# Altium schematic sheet Connectors.SchDoc
size Letter
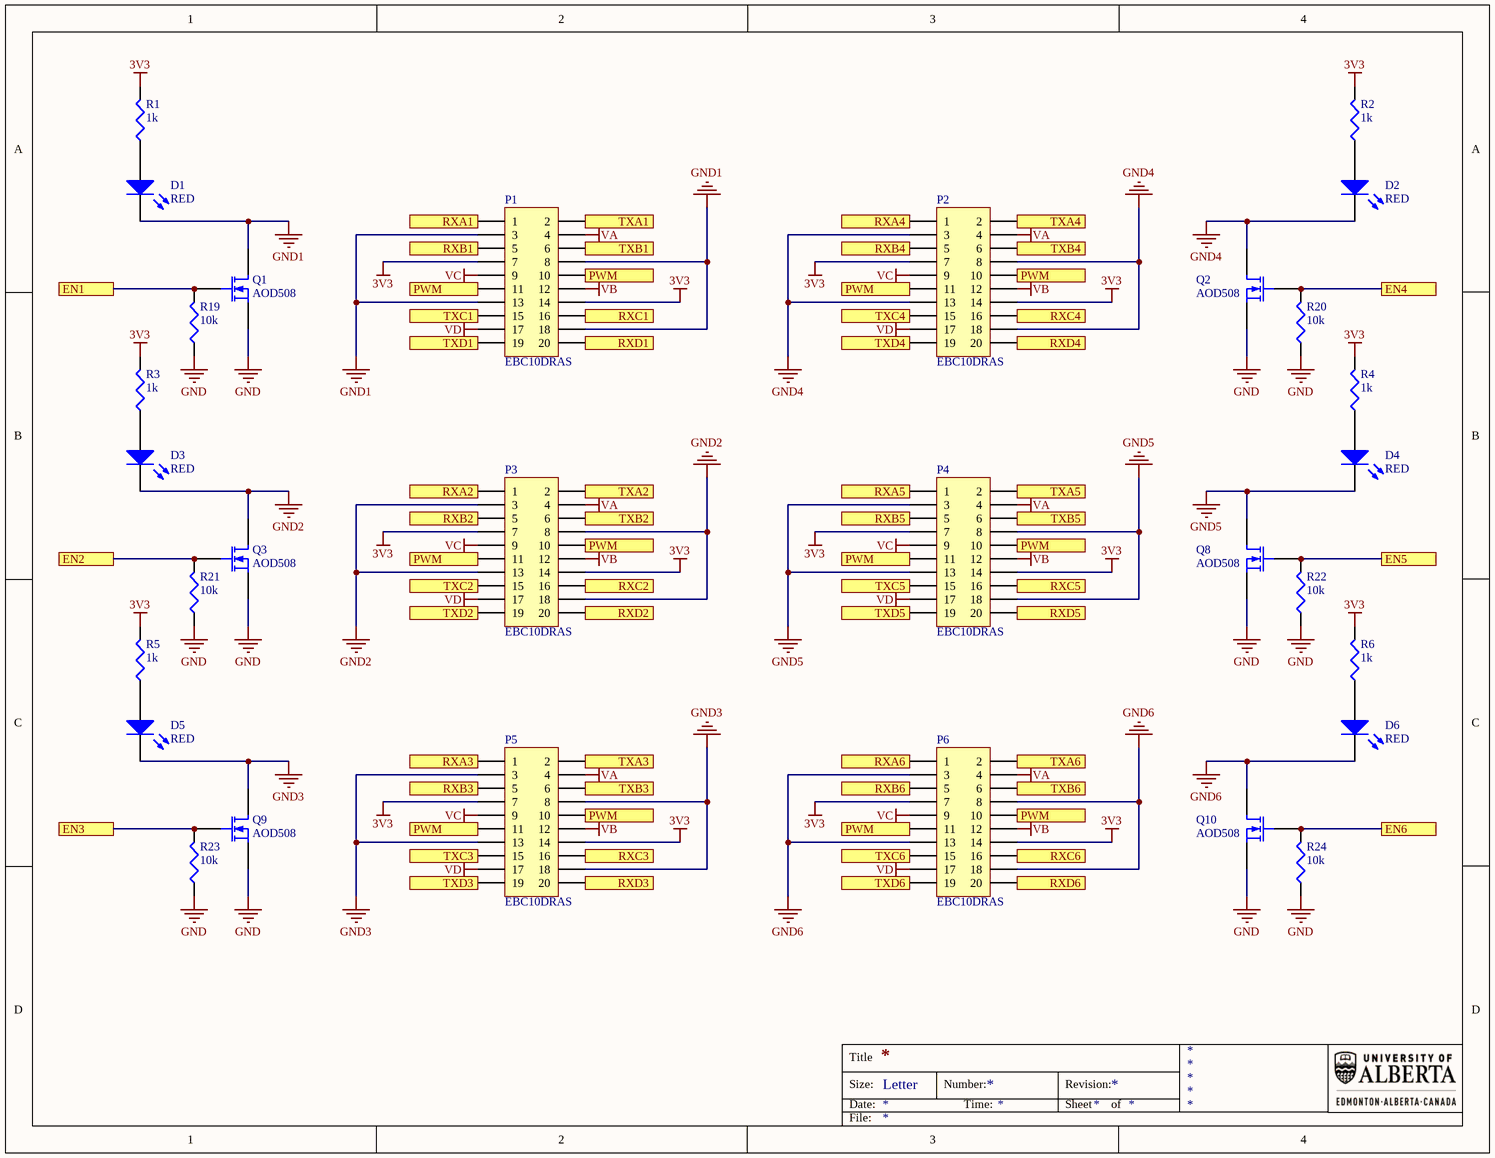
[diagram p0: Connectors.SchDoc]

## Parts
D1  value RED  [WL-150060XS75000]  (hidden comment: LED)
D2  value RED  [WL-150060XS75000]  (hidden comment: LED)
D3  value RED  [WL-150060XS75000]  (hidden comment: LED)
D4  value RED  [WL-150060XS75000]  (hidden comment: LED)
D5  value RED  [WL-150060XS75000]  (hidden comment: LED)
D6  value RED  [WL-150060XS75000]  (hidden comment: LED)
P1  Manufacturer Part Number: EBC10DRAS  [SLN-EBC10DRAS]  (hidden comment: Header 10x2)
P2  Manufacturer Part Number: EBC10DRAS  [SLN-EBC10DRAS]  (hidden comment: Header 10x2)
P3  Manufacturer Part Number: EBC10DRAS  [SLN-EBC10DRAS]  (hidden comment: Header 10x2)
P4  Manufacturer Part Number: EBC10DRAS  [SLN-EBC10DRAS]  (hidden comment: Header 10x2)
P5  Manufacturer Part Number: EBC10DRAS  [SLN-EBC10DRAS]  (hidden comment: Header 10x2)
P6  Manufacturer Part Number: EBC10DRAS  [SLN-EBC10DRAS]  (hidden comment: Header 10x2)
Q1  AOD508  [AO-TO252]
Q2  AOD508  [AO-TO252]
Q3  AOD508  [AO-TO252]
Q8  AOD508  [AO-TO252]
Q9  AOD508  [AO-TO252]
Q10  AOD508  [AO-TO252]
R1  value 1k  [PANA-ERJ3EK]  (hidden comment: Res3)
R2  value 1k  [PANA-ERJ3EK]  (hidden comment: Res3)
R3  value 1k  [PANA-ERJ3EK]  (hidden comment: Res3)
R4  value 1k  [PANA-ERJ3EK]  (hidden comment: Res3)
R5  value 1k  [PANA-ERJ3EK]  (hidden comment: Res3)
R6  value 1k  [PANA-ERJ3EK]  (hidden comment: Res3)
R19  value 10k  [PANA-ERJ3EK]  (hidden comment: Res3)
R20  value 10k  [PANA-ERJ3EK]  (hidden comment: Res3)
R21  value 10k  [PANA-ERJ3EK]  (hidden comment: Res3)
R22  value 10k  [PANA-ERJ3EK]  (hidden comment: Res3)
R23  value 10k  [PANA-ERJ3EK]  (hidden comment: Res3)
R24  value 10k  [PANA-ERJ3EK]  (hidden comment: Res3)

## Ports
EN1, EN2, EN3, EN4, EN5, EN6, PWM, RXA1, RXA2, RXA3, RXA4, RXA5, RXA6, RXB1, RXB2, RXB3, RXB4, RXB5, RXB6, RXC1, RXC2, RXC3, RXC4, RXC5, RXC6, RXD1, RXD2, RXD3, RXD4, RXD5, RXD6, TXA1, TXA2, TXA3, TXA4, TXA5, TXA6, TXB1, TXB2, TXB3, TXB4, TXB5, TXB6, TXC1, TXC2, TXC3, TXC4, TXC5, TXC6, TXD1, TXD2, TXD3, TXD4, TXD5, TXD6

## Nets
3V3: P1.7 P1.14 P2.7 P2.14 P3.7 P3.14 P4.7 P4.14 P5.7 P5.14 P6.7 P6.14 R1.2 R2.2 R3.2 R4.2 R5.2 R6.2
GND: Q1.3(S) Q2.3(S) Q3.3(S) Q8.3(S) Q9.3(S) Q10.3(S) R19.1 R20.1 R21.1 R22.1 R23.1 R24.1
GND1: D1.2(K) P1.3 P1.8 P1.13 P1.18 Q1.1(D)
GND2: D3.2(K) P3.3 P3.8 P3.13 P3.18 Q3.1(D)
GND3: D5.2(K) P5.3 P5.8 P5.13 P5.18 Q9.1(D)
GND4: D2.2(K) P2.3 P2.8 P2.13 P2.18 Q2.1(D)
GND5: D4.2(K) P4.3 P4.8 P4.13 P4.18 Q8.1(D)
GND6: D6.2(K) P6.3 P6.8 P6.13 P6.18 Q10.1(D)
VA: P1.4 P2.4 P3.4 P4.4 P5.4 P6.4
VB: P1.12 P2.12 P3.12 P4.12 P5.12 P6.12
VC: P1.9 P2.9 P3.9 P4.9 P5.9 P6.9
VD: P1.17 P2.17 P3.17 P4.17 P5.17 P6.17
EN1: Q1.2(G) R19.2 ; port EN1
EN2: Q3.2(G) R21.2 ; port EN2
EN3: Q9.2(G) R23.2 ; port EN3
EN4: Q2.2(G) R20.2 ; port EN4
EN5: Q8.2(G) R22.2 ; port EN5
EN6: Q10.2(G) R24.2 ; port EN6
PWM: P1.10 P1.11 P2.10 P2.11 P3.10 P3.11 P4.10 P4.11 P5.10 P5.11 P6.10 P6.11 ; port PWM
RXA1: P1.1 ; port RXA1
RXA2: P3.1 ; port RXA2
RXA3: P5.1 ; port RXA3
RXA4: P2.1 ; port RXA4
RXA5: P4.1 ; port RXA5
RXA6: P6.1 ; port RXA6
RXB1: P1.5 ; port RXB1
RXB2: P3.5 ; port RXB2
RXB3: P5.5 ; port RXB3
RXB4: P2.5 ; port RXB4
RXB5: P4.5 ; port RXB5
RXB6: P6.5 ; port RXB6
RXC1: P1.16 ; port RXC1
RXC2: P3.16 ; port RXC2
RXC3: P5.16 ; port RXC3
RXC4: P2.16 ; port RXC4
RXC5: P4.16 ; port RXC5
RXC6: P6.16 ; port RXC6
RXD1: P1.20 ; port RXD1
RXD2: P3.20 ; port RXD2
RXD3: P5.20 ; port RXD3
RXD4: P2.20 ; port RXD4
RXD5: P4.20 ; port RXD5
RXD6: P6.20 ; port RXD6
TXA1: P1.2 ; port TXA1
TXA2: P3.2 ; port TXA2
TXA3: P5.2 ; port TXA3
TXA4: P2.2 ; port TXA4
TXA5: P4.2 ; port TXA5
TXA6: P6.2 ; port TXA6
TXB1: P1.6 ; port TXB1
TXB2: P3.6 ; port TXB2
TXB3: P5.6 ; port TXB3
TXB4: P2.6 ; port TXB4
TXB5: P4.6 ; port TXB5
TXB6: P6.6 ; port TXB6
TXC1: P1.15 ; port TXC1
TXC2: P3.15 ; port TXC2
TXC3: P5.15 ; port TXC3
TXC4: P2.15 ; port TXC4
TXC5: P4.15 ; port TXC5
TXC6: P6.15 ; port TXC6
TXD1: P1.19 ; port TXD1
TXD2: P3.19 ; port TXD2
TXD3: P5.19 ; port TXD3
TXD4: P2.19 ; port TXD4
TXD5: P4.19 ; port TXD5
TXD6: P6.19 ; port TXD6
NetD1_1: D1.1(A) R1.1
NetD2_1: D2.1(A) R2.1
NetD3_1: D3.1(A) R3.1
NetD4_1: D4.1(A) R4.1
NetD5_1: D5.1(A) R5.1
NetD6_1: D6.1(A) R6.1

## Notes on the sheet
- Title
- Size:
- Date:
- Letter
- Number:
- Time:
- Revision:
- Sheet
- of
- File:

## Library data of the parts
D1-D6 = 3: LED RED CLEAR 0603 SMD; Part Number: 3; Manufacturer Part Number: 150060RS75000; Designator: D?; Brightness: 250mcd; Published: 8-Jun-2000; LatestRevisionDate: 08-Jul-2005; LatestRevisionNote: Mech Layer 1 removed.; PackageReference: WL-150060XS75000; Publisher: Altium Limited; PackageDescription: LED; 2 Leads; Supplier Part Number 1: 732-4978-1-ND; Supplier 1: Digi-Key; Supplier Link: http://www.digikey.ca/product-search/en?keywords=732-4978-1-ND
P1-P6 = PP-SLN-00105: CONN EDGE DUAL FMALE 20POS 0.100; Index: 105; Designator: P?; Number of Positions: 20; Pitch: 0.100" (2.54mm); LatestRevisionDate: 3/22/2018; LatestRevisionNote: ...; Publisher: AlbertaSat; Part Number: PP-SLN-00105; Supplier Part Number 1: S3300-ND; Supplier 1: Digi-key; Published: 3/22/2018; PackageReference: SLN-EBC10DRAS; PackageDescription: CONN EDGE DUAL FMALE 20POS 0.100; Supplier Link: #https://www.digikey.ca/product-detail/en/sullins-connector-solutions/EBC10DRAS/S3300-ND/927252#; Number of Rows: 2; Mounting Type: Through Hole
Q1-Q3 Q8-Q10 = 1: MOSFET N-CH 30V 22A TO252; Part Number: 1; Designator: Q?; Published: 8-Jun-2000; LatestRevisionDate: 17-Jul-2002; LatestRevisionNote: Re-released for DXP Platform.; PackageVersion: 1995/1996; PackageReference: AO-TO252; Publisher: Altium Limited; PackageDescription: TO, Flat Index; 3 In-Line, Axial Leads; Body Dia. 4.6mm; Lead Dia. 0.5 mm (max); Manufacturer Part Number: AOD508; Supplier Part Number 1: 785-1355-1-ND; Supplier 1: Digi-Key; Supplier Link: #http://www.digikey.ca/product-search/en?keywords=785-1355-1-ND#
R1-R6 = 15398: RES SMD 1K OHM 1% 1/10W 0603; Part Number: 15398; Manufacturer Part Number: ERJ-3EKF1001V; Designator: R?; Power: 0.1W, 1/10W; Temperature Coefficient: ±100ppm/°C; Published: 8-Jun-2000; LatestRevisionDate: 29-May-2009; LatestRevisionNote: IPC-7351 Footprint Added.; PackageReference: 0603 (1608 Metric); Publisher: Altium Limited; PackageDescription: Chip Resistor, 2-Leads, Body 1.60x0.80mm, IPC Low Density; Supplier Part Number 1: P1.00KHCT-ND; Supplier 1: Digi-Key; Supplier Link: http://www.digikey.ca/product-search/en?keywords=P1.00KHCT-ND; Tolerance: ±1%
R19-R24 = 17203: RES SMD 10K OHM 1% 1/10W 0603; Part Number: 17203; Manufacturer Part Number: ERJ-3EKF1002V; Designator: R?; Power: 0.1W, 1/10W; Temperature Coefficient: ±100ppm/°C; Published: 8-Jun-2000; LatestRevisionDate: 29-May-2009; LatestRevisionNote: IPC-7351 Footprint Added.; PackageReference: 0603 (1608 Metric); Publisher: Altium Limited; PackageDescription: Chip Resistor, 2-Leads, Body 1.60x0.80mm, IPC Low Density; Supplier Part Number 1: P10.0KHCT-ND; Supplier 1: Digi-Key; Supplier Link: http://www.digikey.ca/product-search/en?keywords=P10.0KHCT-ND; Tolerance: ±1%